# EAGLE design rotary-encoders (EAGLE 8.0.1)
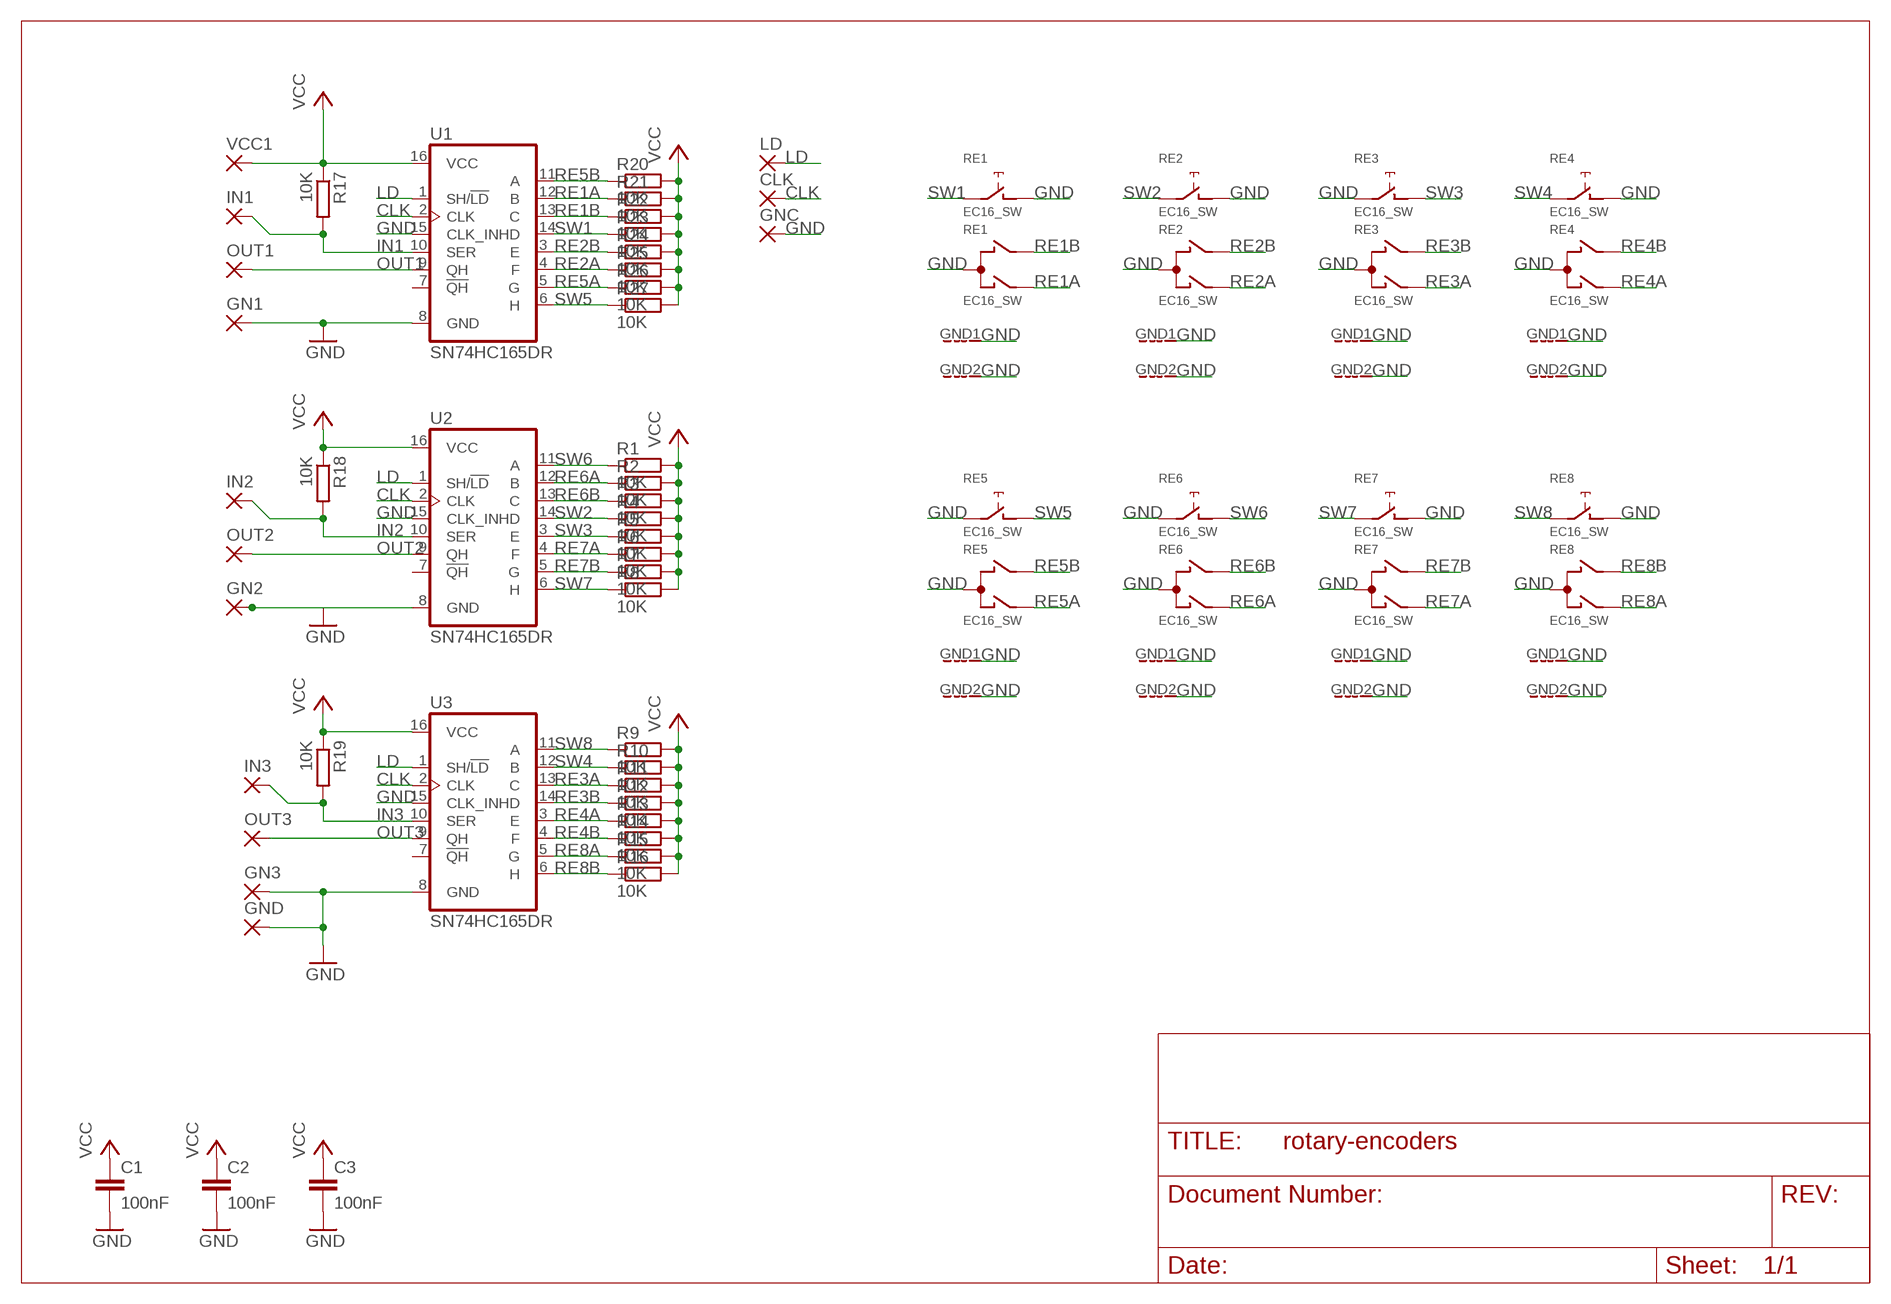
[diagram p0: schematic, sheet 1]

## Parts
C1  100nF  C-EUC0805  [C0805]
C2  100nF  C-EUC0805  [C0805]
C3  100nF  C-EUC0805  [C0805]
CLK  1,6/0,9  [1,6/0,9]
GN1  1,6/0,9  [1,6/0,9]
GN2  1,6/0,9  [1,6/0,9]
GN3  1,6/0,9  [1,6/0,9]
GNC  1,6/0,9  [1,6/0,9]
GND  1,6/0,9  [1,6/0,9]
IN1  1,6/0,9  [1,6/0,9]
IN2  1,6/0,9  [1,6/0,9]
IN3  1,6/0,9  [1,6/0,9]
LD  1,6/0,9  [1,6/0,9]
OUT1  1,6/0,9  [1,6/0,9]
OUT2  1,6/0,9  [1,6/0,9]
OUT3  1,6/0,9  [1,6/0,9]
R1  10K  R-EU_R0805  [R0805]
R2  10K  R-EU_R0805  [R0805]
R3  10K  R-EU_R0805  [R0805]
R4  10K  R-EU_R0805  [R0805]
R5  10K  R-EU_R0805  [R0805]
R6  10K  R-EU_R0805  [R0805]
R7  10K  R-EU_R0805  [R0805]
R8  10K  R-EU_R0805  [R0805]
R9  10K  R-EU_R0805  [R0805]
R10  10K  R-EU_R0805  [R0805]
R11  10K  R-EU_R0805  [R0805]
R12  10K  R-EU_R0805  [R0805]
R13  10K  R-EU_R0805  [R0805]
R14  10K  R-EU_R0805  [R0805]
R15  10K  R-EU_R0805  [R0805]
R16  10K  R-EU_R0805  [R0805]
R17  10K  R-EU_R0805  [R0805]
R18  10K  R-EU_R0805  [R0805]
R19  10K  R-EU_R0805  [R0805]
R20  10K  R-EU_R0805  [R0805]
R21  10K  R-EU_R0805  [R0805]
R22  10K  R-EU_R0805  [R0805]
R23  10K  R-EU_R0805  [R0805]
R24  10K  R-EU_R0805  [R0805]
R25  10K  R-EU_R0805  [R0805]
R26  10K  R-EU_R0805  [R0805]
R27  10K  R-EU_R0805  [R0805]
RE1  EC16_SW  [EC16_SW]
RE2  EC16_SW  [EC16_SW]
RE3  EC16_SW  [EC16_SW]
RE4  EC16_SW  [EC16_SW]
RE5  EC16_SW  [EC16_SW]
RE6  EC16_SW  [EC16_SW]
RE7  EC16_SW  [EC16_SW]
RE8  EC16_SW  [EC16_SW]
U1  SN74HC165DR  74HC165D  [SO16]
U2  SN74HC165DR  74HC165D  [SO16]
U3  SN74HC165DR  74HC165D  [SO16]
VCC1  1,6/0,9  [1,6/0,9]

## Nets
CLK: CLK.1(P) U1.2(CLK) U2.2(CLK) U3.2(CLK)
GND: C1.2 C2.2 C3.2 GN1.1(P) GN2.1(P) GN3.1(P) GNC.1(P) GND.1(P) RE1.C RE1.D RE1.GND1(G) RE1.GND2(G) RE2.C RE2.D RE2.GND1(G) RE2.GND2(G) RE3.C RE3.E RE3.GND1(G) RE3.GND2(G) RE4.C RE4.D RE4.GND1(G) RE4.GND2(G) RE5.C RE5.E RE5.GND1(G) RE5.GND2(G) RE6.C RE6.E RE6.GND1(G) RE6.GND2(G) RE7.C RE7.D RE7.GND1(G) RE7.GND2(G) RE8.C RE8.D RE8.GND1(G) RE8.GND2(G) U1.8(GND) U1.15(CLK_INH) U2.8(GND) U2.15(CLK_INH) U3.8(GND) U3.15(CLK_INH)
IN1: IN1.1(P) R17.2 U1.10(SER)
IN2: IN2.1(P) R18.2 U2.10(SER)
IN3: IN3.1(P) R19.2 U3.10(SER)
LD: LD.1(P) U1.1(SH/!LD) U2.1(SH/!LD) U3.1(SH/!LD)
OUT1: OUT1.1(P) U1.9(QH)
OUT2: OUT2.1(P) U2.9(QH)
OUT3: OUT3.1(P) U3.9(QH)
RE1A: R21.1 RE1.A U1.12(B)
RE1B: R22.1 RE1.B U1.13(C)
RE2A: R25.1 RE2.A U1.4(F)
RE2B: R24.1 RE2.B U1.3(E)
RE3A: R11.1 RE3.A U3.13(C)
RE3B: R12.1 RE3.B U3.14(D)
RE4A: R13.1 RE4.A U3.3(E)
RE4B: R14.1 RE4.B U3.4(F)
RE5A: R26.1 RE5.A U1.5(G)
RE5B: R20.1 RE5.B U1.11(A)
RE6A: R2.1 RE6.A U2.12(B)
RE6B: R3.1 RE6.B U2.13(C)
RE7A: R6.1 RE7.A U2.4(F)
RE7B: R7.1 RE7.B U2.5(G)
RE8A: R15.1 RE8.A U3.5(G)
RE8B: R16.1 RE8.B U3.6(H)
SW1: R23.1 RE1.E U1.14(D)
SW2: R4.1 RE2.E U2.14(D)
SW3: R5.1 RE3.D U2.3(E)
SW4: R10.1 RE4.E U3.12(B)
SW5: R27.1 RE5.D U1.6(H)
SW6: R1.1 RE6.D U2.11(A)
SW7: R8.1 RE7.E U2.6(H)
SW8: R9.1 RE8.E U3.11(A)
VCC: C1.1 C2.1 C3.1 R1.2 R2.2 R3.2 R4.2 R5.2 R6.2 R7.2 R8.2 R9.2 R10.2 R11.2 R12.2 R13.2 R14.2 R15.2 R16.2 R17.1 R18.1 R19.1 R20.2 R21.2 R22.2 R23.2 R24.2 R25.2 R26.2 R27.2 U1.16(VCC) U2.16(VCC) U3.16(VCC) VCC1.1(P)
Unconnected: U1.7(!QH) U2.7(!QH) U3.7(!QH)

## Library data of the parts
C1-C3 = resistor:C-EU: CAPACITOR, European symbol
CLK GN1-GN3 GNC GND IN1-IN3 LD OUT1-OUT3 VCC1 = wirepad:1,6/0,9: THROUGH-HOLE PAD
R1-R27 = resistor:R-EU_: RESISTOR, European symbol
RE1-RE8 = custom:EC16_SW: Aliexpress rotary Encoder EC16 with switch
U1-U3 = SparkFun-IC-Logic:74*165: 8-Bit Shift Register (Parallel to Serial) Datasheet <https://cdn.sparkfun.com/datasheets/BreakoutBoards/sn54hc165.pdf> SparkFun Products SparkFun Shift-In Breakout - SN74HC165 <https://www.sparkfun.com/products/11733> (BOB-11733); PROD_ID: IC-11325

## Board
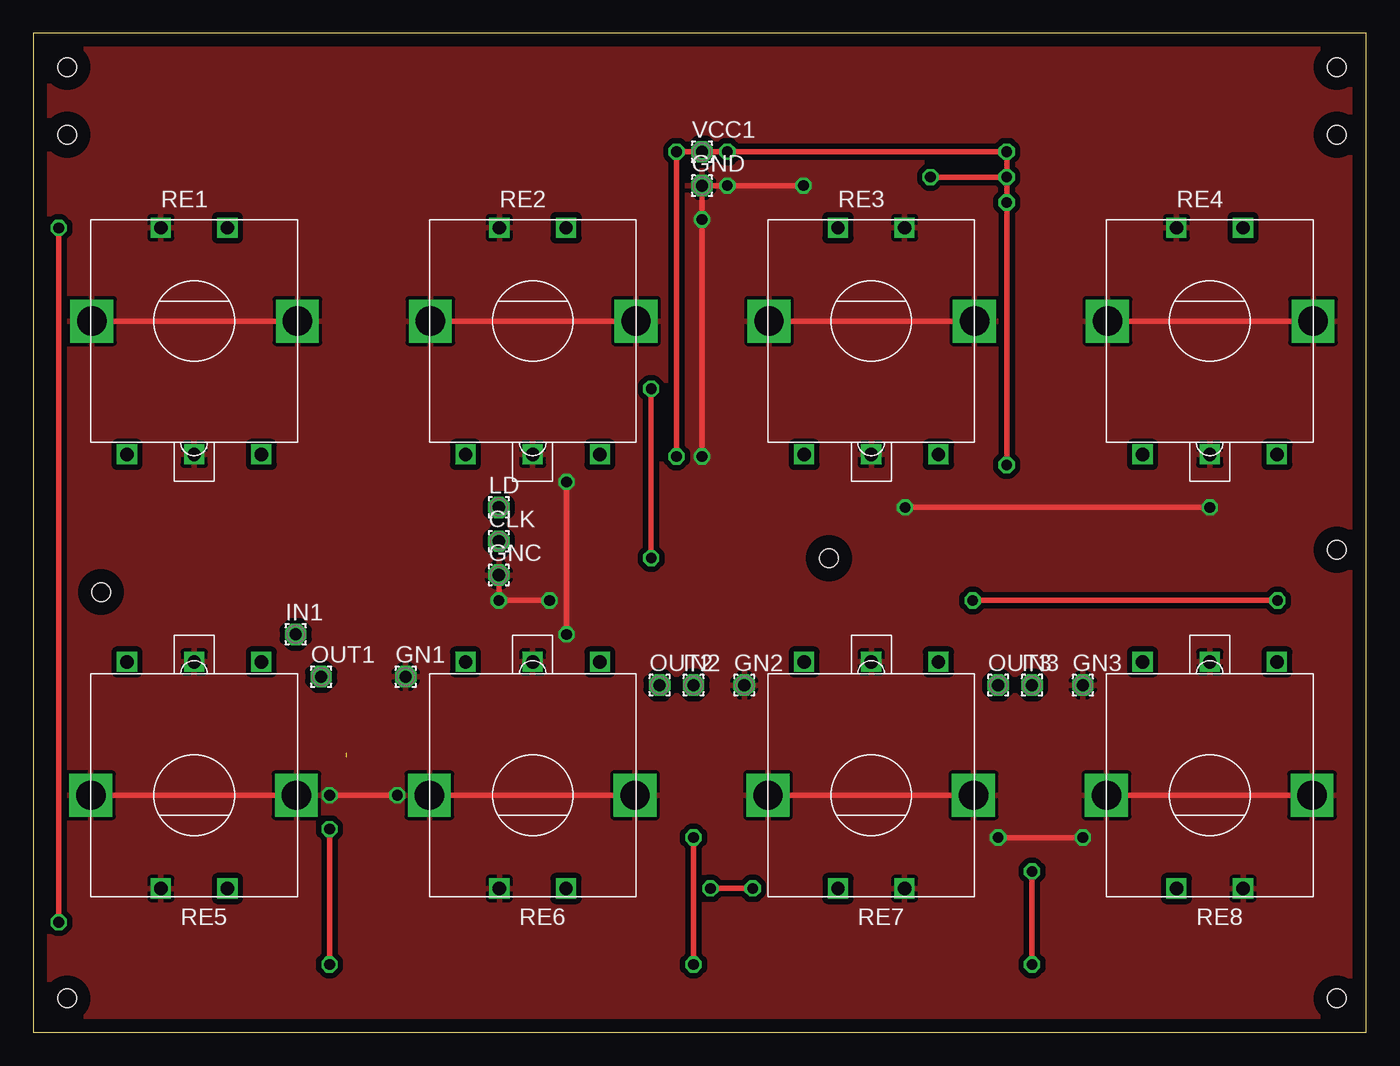
[diagram p1: board, top side]
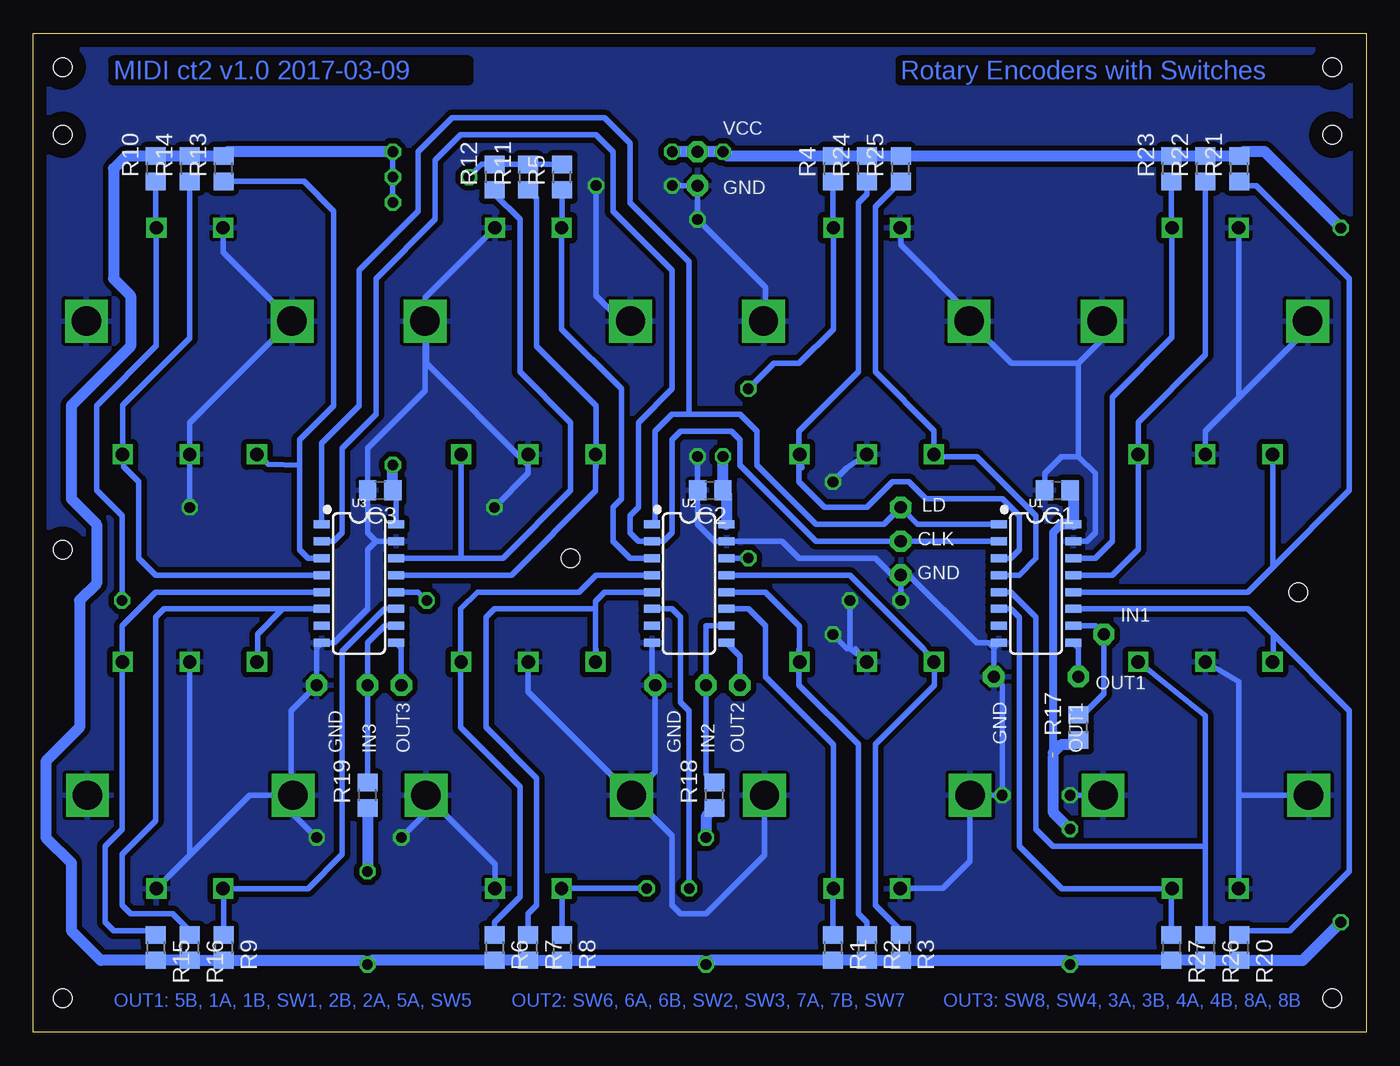
[diagram p2: board, bottom side, seen from below]

Size 100 x 74.92 mm. Coordinates in mm from the lower left corner, seen from the top.
Outline: 0,0 100,0 100,74.92 0,74.92 0,0
Copper layers (1*16): Top 0.035mm / dielectric 1.5mm / Bottom 0.035mm
Design rules "default *": minimum track width 10mil, minimum drill 24mil, track to track 16mil, track to pad 16mil, pad to pad 16mil, via to via 16mil, smd to smd 8mil, copper to edge 40mil, drill to drill 8mil, minimum pad ring 10mil, minimum via ring 8mil, stop-mask expansion 4mil, vias tented up to drill 0mil, thermal gap 10mil
Holes 1.4 mm at 2.54,72.39 97.79,72.39 97.79,2.54 2.54,2.54 2.54,67.31 97.79,67.31 5.08,33.02 59.69,35.56 97.79,36.2
Holes 0.6 mm at -7.92,73.15 -7.7,2.21 106.83,2.21 106.71,73.38
vRestrict: area 22.2,27.9 to 27.3,39.4; area 48.3,27.9 to 53.3,39.4; area 73,27.9 to 78.1,39.4

### Footprints (pad centres in the part's own frame; a part is rotated, then mirrored left to right if it is on the bottom)
C0805 = smd 1.3 x 1.5: 1 -0.95,0; 2 0.95,0
1,6/0,9 = drill 0.914 pad 1.6 octagon: 1 0,0
R0805 = smd 1.3 x 1.5: 1 -0.95,0; 2 0.95,0
EC16_SW = drill 1 square: A -5.04,-10; B 5.04,-10; C 0,-10; D -2.5,7; E 2.5,7 | drill 2.2 square: GND1 -7.675,0; GND2 7.75,0
SO16 = smd 0.6 x 1.2: 1 -4.445,-2.8; 2 -3.175,-2.8; 3 -1.905,-2.8; 4 -0.635,-2.8; 5 0.635,-2.8; 6 1.905,-2.8; 7 3.175,-2.8; 8 4.445,-2.8; 9 4.445,2.8; 10 3.175,2.8; 11 1.905,2.8; 12 0.635,2.8; 13 -0.635,2.8; 14 -1.905,2.8; 15 -3.175,2.8; 16 -4.445,2.8

### Placement (x,y rotation side)
C1  23.18,40.64 180 bottom
C2  49.21,40.64 180 bottom
C3  73.97,40.64 180 bottom
CLK  34.92,36.83 0 top
GN1  27.94,26.67 0 top
GN2  53.34,26.04 0 top
GN3  78.74,26.04 0 top
GNC  34.92,34.29 0 top
GND  50.16,63.5 0 top
IN1  19.68,29.84 0 top
IN2  49.53,26.04 0 top
IN3  74.93,26.04 0 top
LD  34.92,39.37 0 top
OUT1  21.59,26.67 0 top
OUT2  46.99,26.04 0 top
OUT3  72.39,26.04 0 top
R1  40.01,6.35 270 bottom
R2  37.47,6.35 270 bottom
R3  34.92,6.35 270 bottom
R4  40.01,64.77 90 bottom
R5  60.33,64.14 90 bottom
R6  65.41,6.35 270 bottom
R7  62.87,6.35 270 bottom
R8  60.33,6.35 270 bottom
R9  85.72,6.35 270 bottom
R10  90.81,64.77 90 bottom
R11  62.87,64.14 90 bottom
R12  65.41,64.14 90 bottom
R13  85.72,64.77 90 bottom
R14  88.27,64.77 90 bottom
R15  90.81,6.35 270 bottom
R16  88.27,6.35 270 bottom
R17  21.59,22.86 90 bottom
R18  48.9,17.78 90 bottom
R19  74.93,17.78 90 bottom
R20  9.53,6.35 270 bottom
R21  9.53,64.77 90 bottom
R22  12.06,64.77 90 bottom
R23  14.61,64.77 90 bottom
R24  37.47,64.77 90 bottom
R25  34.92,64.77 90 bottom
R26  12.06,6.35 270 bottom
R27  14.61,6.35 270 bottom
RE1  12.06,53.34 0 top
RE2  37.47,53.34 0 top
RE3  62.87,53.34 0 top
RE4  88.27,53.34 0 top
RE5  12.06,17.78 180 top
RE6  37.47,17.78 180 top
RE7  62.87,17.78 180 top
RE8  88.27,17.78 180 top
U1  24.77,33.66 270 bottom
U2  50.8,33.66 270 bottom
U3  75.56,33.66 270 bottom
VCC1  50.16,66.04 0 top

### Tracks (layer width: path | path; a pad name or v marks a point on that pad's centre or on a via)
CLK
  Bottom 0.406: U1.2 CLK.1 41.27,36.83 46.99,42.55 46.99,44.45 47.62,45.09 51.44,45.09 52.07,44.45 52.07,37.47 52.7,36.83 U2.2 54.61,36.83 55.24,37.47 55.24,38.73 54.61,39.37 54.61,45.72 52.07,48.26 52.07,57.15 56.52,61.59 56.52,66.04 57.78,67.31 67.94,67.31 69.85,65.41 69.85,60.96 74.3,56.52 74.3,46.35 76.83,43.81 76.83,37.47 77.47,36.83 U3.2
GND  (via drill 0.8)
  Top 0.406: RE1.GND1 RE1.GND2 | v50.16,43.18 v50.16,60.96 GND.1 v52.07,63.5 v57.78,63.5 | v40.01,41.27 v40.01,29.84 | v22.23,17.78 v27.3,17.78 | v38.73,32.38 v34.92,32.38 GNC.1 | RE5.GND2 20.32,17.78 | RE2.GND1 RE2.GND2 | RE6.GND2 RE6.GND1 | RE3.GND1 RE3.GND2 | RE4.GND1 RE4.GND2 | RE8.GND2 RE8.GND1 | RE7.GND2 RE7.GND1 | v72.39,14.61 v78.74,14.61 | v65.41,39.37 v88.27,39.37
  Bottom 0.406: RE1.D 9.56,47.59 12.06,45.09 RE1.C | C1.2 24.12,41.91 22.86,43.18 21.59,43.18 | U1.15 20.95,36.83 20.32,37.47 20.32,41.91 21.59,43.18 | RE1.GND1 4.39,52.76 9.53,47.62 | RE1.GND2 19.82,51.94 21.59,50.16 | 21.59,50.16 21.59,43.18 | 9.56,17.78 RE5.E | 9.56,17.78 9.56,26.28 RE5.C | 27.94,28.84 GN1.1 27.3,26.04 v27.3,17.78 29.84,17.78 | 27.94,28.84 U1.8 | RE5.GND2 9.56,17.78 | RE5.GND1 v22.23,17.78 | RE6.GND2 29.71,12.83 31.75,10.79 34.95,10.79 RE6.E | GNC.1 34.29,34.29 29.21,29.21 28.32,29.21 27.94,28.84 | v50.16,43.18 v50.16,43.17 C2.2 50.16,38.09 48.9,36.83 U2.15 43.81,36.83 42.55,35.56 36.83,35.56 35.56,34.29 GNC.1 | RE2.GND2 45.09,53.47 45.09,55.88 v50.16,60.96 GND.1 v52.07,63.5 | 38.3,28.78 RE6.C 38.73,28.78 | RE2.C 38.94,42.34 v40.01,41.27 | 38.73,28.78 38.94,28.78 v40.01,29.84 | v38.73,32.38 38.73,28.78 | GNC.1 v34.92,32.38 | RE6.GND1 45.14,13.28 49.53,8.89 51.44,8.89 52.07,9.53 52.07,14.73 RE7.GND2 | 21.59,50.16 26.61,50.16 RE2.GND1 29.79,53.92 34.92,59.05 34.92,60.3 RE2.D | RE3.GND2 70.48,53.21 70.48,50.16 62.87,42.55 RE3.C 62.87,41.91 v65.41,39.37 | RE3.GND2 70.61,55.09 RE3.E | RE7.C 62.87,25.53 RE7.GND2 | U2.8 53.6,26.3 GN2.1 53.34,19.55 RE7.GND2 | RE7.D 65.36,12.61 RE7.GND1 70.54,16.45 v72.39,14.61 | 74.3,36.83 74.92,37.46 C3.2 74.93,43.81 70.61,48.13 RE3.GND2 | 74.3,36.83 U3.15 | 74.3,36.83 74.93,36.2 74.93,31.75 77.47,29.21 U3.8 78.74,28.84 GN3.1 80.64,24.13 80.64,17.91 RE8.GND2 | RE4.D 85.77,58.52 RE4.GND1 80.64,53.34 88.27,45.72 RE4.C v88.27,39.37 | 88.27,13.28 RE8.C | 88.27,13.28 RE8.D | RE8.GND2 83.77,17.78 88.27,13.28 | v78.74,14.61 80.64,16.51 80.64,17.65 RE8.GND2
  Bottom 0.406: v57.78,63.5 57.78,55.24 55.88,53.34 RE3.GND1
  pour Bottom: 0,74.93 100.33,74.93 100.33,0 0,0
  pour Top: 0,74.93 100.33,74.93 100.33,0 0,0
IN1
  Bottom 0.406: U1.10 20.32,30.48 IN1.1 19.68,25.4 21.27,23.81 R17.2
IN2
  Bottom 0.406: U2.10 49.53,30.48 IN2.1 49.53,19.36 R18.2
IN3
  Bottom 0.406: U3.10 73.66,30.48 74.93,29.21 IN3.1 R19.2
LD
  Bottom 0.406: U1.1 33.66,38.1 LD.1 36.2,38.1 41.27,38.1 45.72,42.55 45.72,45.09 46.99,46.35 50.8,46.35 | U2.1 53.34,38.36 53.34,45.09 52.07,46.35 50.8,46.35 | 50.8,46.35 50.8,57.78 55.24,62.23 55.24,66.67 57.15,68.58 68.58,68.58 71.12,66.04 71.12,61.59 75.56,57.15 75.56,46.99 78.36,44.19 U3.1
OUT1
  Bottom 0.406: OUT1.1 21.59,27.3 21.59,28.84 U1.9
OUT2
  Bottom 0.406: OUT2.1 46.99,28.2 U2.9
OUT3
  Bottom 0.406: OUT3.1 72.39,28.84 U3.9
RE1A
  Bottom 0.406: RE1.A 7.03,34.88 | 7.03,34.88 8.89,33.02 U1.12 | 7.03,34.88 1.27,40.64 1.27,56.52 8.26,63.5 9.21,63.5 R21.1
RE1B
  Bottom 0.406: U1.13 19.05,34.29 17.11,36.23 RE1.B 17.11,45.76 12.06,50.8 R22.1
RE2A
  Bottom 0.406: U1.4 26.04,34.29 24.77,35.56 24.77,38.73 29.21,43.18 32.27,43.18 RE2.A 32.42,45.12 36.83,49.53 36.83,61.91 R25.1
RE2B
  Bottom 0.406: RE2.B 42.34,42.34 42.55,42.55 | U1.3 26.67,35.56 26.04,36.2 26.04,38.73 27.3,40.01 33.02,40.01 34.29,41.27 35.56,41.27 37.47,39.37 40.64,39.37 42.55,41.27 42.55,42.3 RE2.B | R24.1 37.47,62.87 38.1,62.23 38.1,49.53 42.55,45.09 42.55,42.38 RE2.B
RE3A
  Bottom 0.406: R11.1 62.23,62.55 62.23,51.44 57.78,46.99 57.78,42.38 RE3.A 57.83,40.6 64.14,34.29 U3.13
RE3B
  Bottom 0.406: R12.1 65.41,62.87 63.5,60.96 63.5,49.53 59.69,45.72 59.69,40.64 64.77,35.56 67.94,35.56 | 67.94,35.56 U3.14 | RE3.B 67.91,35.6 67.94,35.56
RE4A
  Bottom 0.406: R13.1 79.69,63.82 77.47,61.59 77.47,46.99 80.01,44.45 80.01,42.55 | 80.01,42.55 80.01,36.2 79.38,35.56 U3.3 | RE4.A 82.37,42.59 80.01,42.55
RE4B
  Bottom 0.406: U3.4 90.81,34.29 92.08,35.56 92.08,41.27 93.1,42.3 93.22,42.43 RE4.B 93.31,47.03 88.27,52.07 88.27,63.5 88.58,63.5 R14.1
RE5A
  Bottom 0.406: 12.06,13.97 R26.1 | 12.06,13.97 12.06,23.74 RE5.A | U1.5 26.67,33.02 24.77,31.11 24.77,15.24 23.5,13.97 12.06,13.97
RE5B
  Bottom 0.406: U1.11 8.89,31.75 6.99,29.84 | 6.99,29.84 6.99,28.82 RE5.B | 6.99,29.84 1.27,24.13 1.27,12.06 5.71,7.62 9.21,7.62 R20.1
RE6A
  Bottom 0.406: R2.1 37.47,8.26 38.1,8.89 38.1,21.59 42.55,26.04 42.55,28.74 RE6.A 42.51,30.44 45.09,33.02 U2.12
RE6B
  Bottom 0.406: R3.1 34.92,7.62 36.83,9.53 36.83,21.59 32.38,26.04 32.38,27.6 RE6.B 33.23,28.78 38.73,34.29 U2.13
RE7A
  Bottom 0.406: RE7.A 67.99,27.76 | U2.4 57.78,34.29 59.05,33.02 66.67,33.02 67.94,31.75 67.94,28.82 RE7.A | R6.1 65.41,8.26 63.5,10.16 63.5,18.41 67.94,22.86 67.94,28.74 RE7.A
RE7B
  Bottom 0.406: R7.1 62.87,8.89 62.23,9.53 62.23,19.05 66.04,22.86 66.04,31.11 65.41,31.75 57.83,31.75 | 57.78,28.74 RE7.B 57.83,31.75 | 57.83,31.75 57.83,32.34 57.15,33.02 U2.5
RE8A
  Bottom 0.406: U3.5 90.81,33.02 93.34,30.48 93.34,28.82 RE8.A 93.34,28.74 93.34,15.24 94.61,13.97 94.61,8.26 93.98,7.62 91.44,7.62 91.12,7.3 R15.1
RE8B
  Bottom 0.406: U3.6 80.64,31.75 81.28,31.75 | 81.28,31.75 83.19,29.84 83.19,28.82 RE8.B | R16.1 88.27,7.62 89.53,8.89 92.71,8.89 93.34,9.53 93.34,13.34 90.81,15.88 90.81,31.11 90.17,31.75 81.28,31.75
SW1
  Bottom 0.406: R23.1 14.61,60.38 RE1.E 14.56,52.11 19.05,47.62 19.05,36.83 20.32,35.56 U1.14
SW2  (via drill 0.8)
  Top 0.406: v46.35,35.56 v46.35,48.26
  Bottom 0.406: v46.35,48.26 44.45,50.16 42.55,50.16 39.97,52.74 RE2.E 40.01,60.38 R4.1 | U2.14 v46.35,35.56
SW3
  Bottom 0.406: R5.1 60.33,60.38 RE3.D 60.37,52.74 55.88,48.26 55.88,40.01 56.52,39.37 56.52,36.83 55.24,35.56 U2.3
SW4  (via drill 0.8)
  Top 0.406: v70.48,32.38 v93.34,32.38
  Bottom 0.406: R10.1 90.81,60.38 RE4.E 90.77,51.48 95.25,46.99 95.25,40.64 93.34,38.73 v93.34,32.38 | v70.48,32.38 71.12,33.02 U3.12
SW5
  Bottom 0.406: U1.6 26.67,31.75 26.04,31.11 26.04,13.97 22.84,10.78 RE5.D 14.61,10.74 R27.1
SW6
  Bottom 0.406: R1.1 40.01,10.74 RE6.D 39.97,21.55 45.09,26.67 45.09,30.48 46.35,31.75 U2.11
SW7  (via drill 0.8)
  Top 0.406: v50.8,10.79 v53.98,10.79
  Bottom 0.406: R8.1 60.33,10.74 RE7.E 60.35,10.79 v53.98,10.79 | U2.6 52.07,31.75 51.44,31.11 51.44,24.77 50.8,24.13 v50.8,10.79
SW8
  Bottom 0.406: R9.1 85.72,10.74 RE8.E 79.39,10.78 76.83,13.34 76.83,28.57 73.66,31.75 U3.11
VCC  (via drill 0.8)  (1 unrouted)
  Top 0.406: v48.26,43.18 v48.26,66.04 VCC1.1 v52.07,66.04 v73.03,66.04 v73.03,64.14 | v22.23,15.24 v22.23,5.08 | v49.53,14.61 v49.53,5.08 | v1.91,60.33 v1.91,8.26 | v74.93,12.06 v74.93,5.08 | v67.31,64.14 v73.03,64.14 | v73.03,42.55 v73.03,62.23 v73.03,64.14
  Bottom 0.406: C3.1 72.77,40.38 U3.16 | 48,40.38 C2.1 | C1.1 21.96,40.38 | R5.2 R11.2 R12.2 66.36,65.08 v67.31,64.14 | 21.91,5.4 v22.23,5.08 22.55,5.4 | 21.91,21.59 R17.1 | 47.94,65.72 v48.26,66.04 | 49.21,5.4 v49.53,5.08 49.85,5.4 | 9.21,66.04 R21.2 | 74.61,5.4 v74.93,5.08 75.25,5.4 | v73.03,66.04 v73.03,64.14 v73.03,62.23 | 85.41,66.04 R13.2
  Bottom 0.61: 22.86,38.1 23.5,37.47 23.5,20.95
  Bottom 0.813: 48,40.38 U2.16 | 21.96,40.38 U1.16 22.86,38.1 | R21.2 R22.2 R23.2 R25.2 R24.2 R4.2 47.94,65.72 | R13.2 R14.2 R10.2 93.03,65.72 93.98,64.77 93.98,56.52 92.71,55.24 92.71,51.44 97.16,46.99 97.16,40.01 95.25,38.1 95.25,33.66 96.52,32.38 96.52,22.86 99.06,20.32 99.06,14.61 97.16,12.7 97.16,7.62 94.94,5.4 R15.2 R16.2 R9.2 75.25,5.4 | 23.5,20.64 23.5,16.51 v22.23,15.24 | 21.91,5.4 R27.2 R26.2 R20.2 4.76,5.4 v1.91,8.26 | 22.55,5.4 R3.2 R2.2 R1.2 49.21,5.4 | 23.5,20.95 22.86,21.59 21.91,21.59 | C2.1 v48.26,43.18 | v48.26,66.04 VCC1.1 v52.07,66.04 | 49.85,5.4 R8.2 R7.2 R6.2 74.61,5.4 | R18.1 49.53,16.2 v49.53,14.61 | v1.91,60.33 7.62,66.04 9.21,66.04 | R19.1 v74.93,12.06 | C3.1 v73.03,42.55 | v73.03,66.04 85.41,66.04

### Text on the board
Bottom: Rotary Encoders with Switches | MIDI ct2 v1.0 2017-03-09 | OUT3: SW8, SW4, 3A, 3B, 4A, 4B, 8A, 8B | OUT2: SW6, 6A, 6B, SW2, SW3, 7A, 7B, SW7 | OUT1: 5B, 1A, 1B, SW1, 2B, 2A, 5A, SW5
bNames: VCC | GND | LD | CLK | GND | IN1 | OUT1 | GND | OUT1 | OUT2 | IN2 | GND | OUT3 | IN3 | GND